# EAGLE design controller (EAGLE 7.4.0)
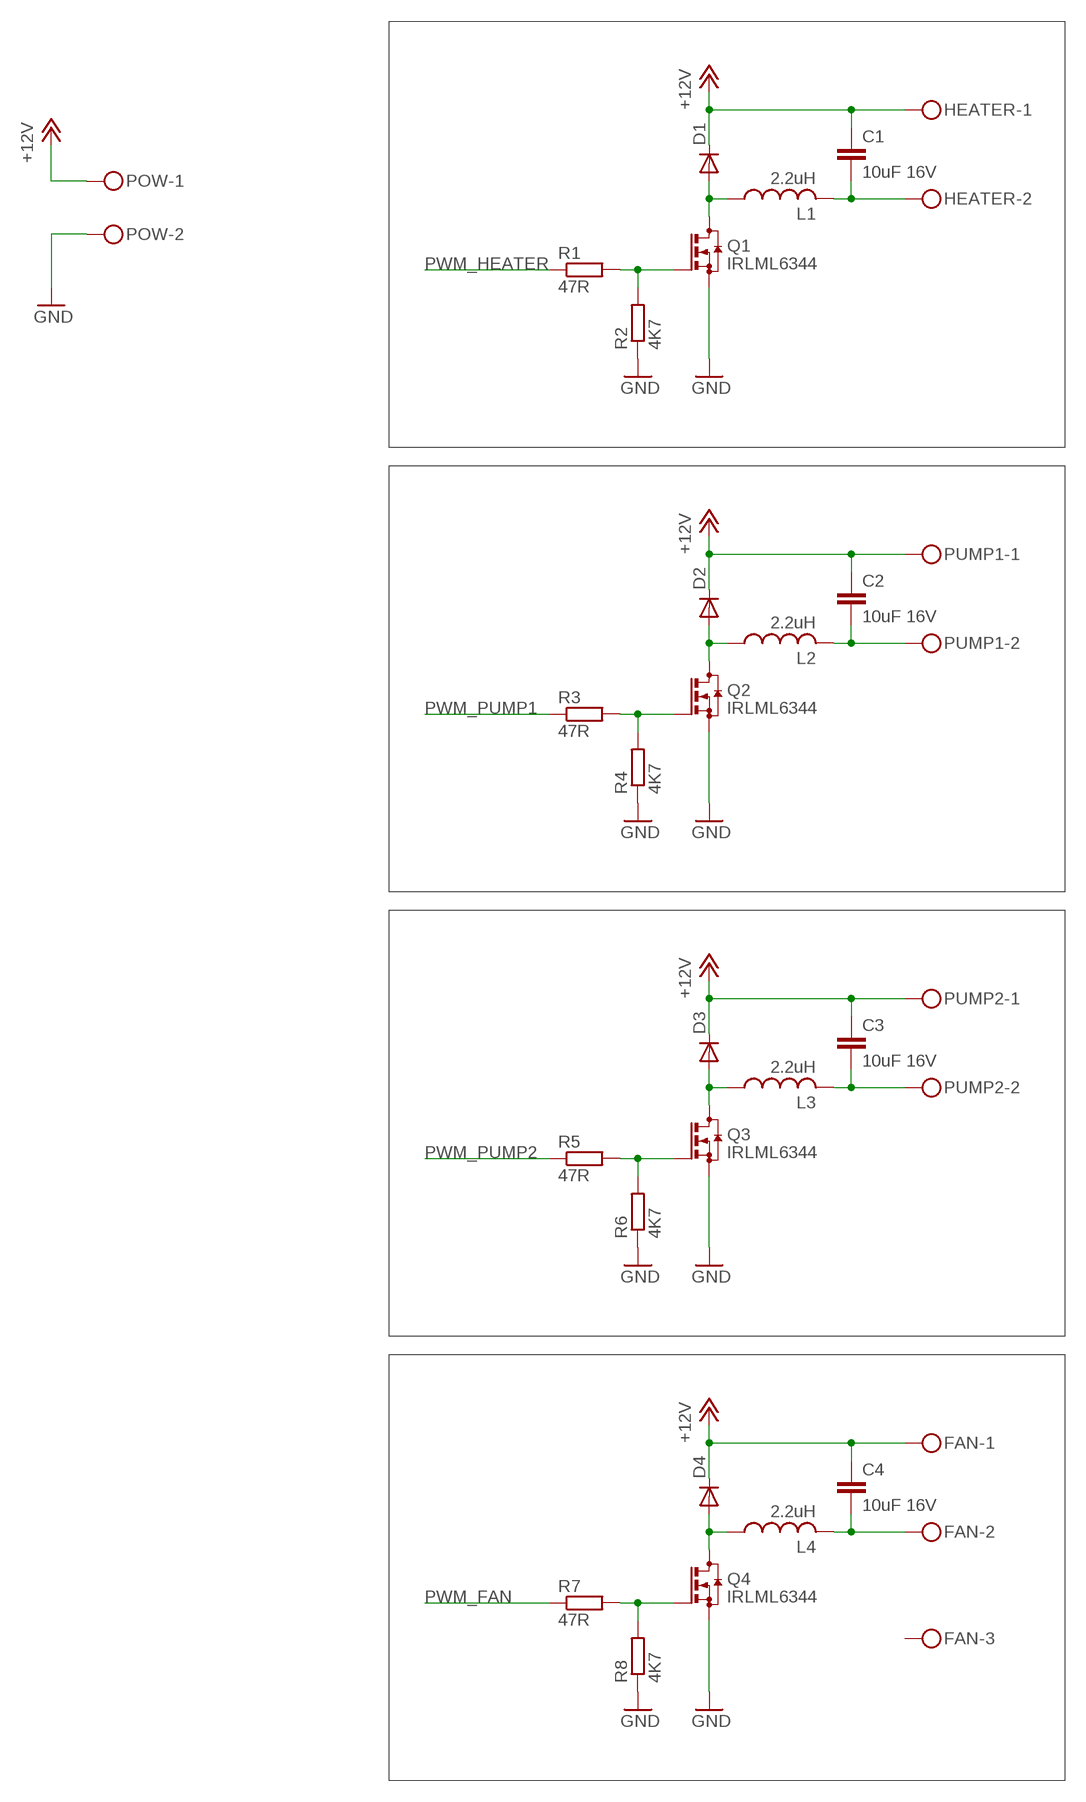
[diagram p0: schematic, sheet 1]

## Parts
C1  10uF 16V  C-EUC1206  [C1206]
C2  10uF 16V  C-EUC1206  [C1206]
C3  10uF 16V  C-EUC1206  [C1206]
C4  10uF 16V  C-EUC1206  [C1206]
D1  DIODE-MINIMELF  [MINIMELF]
D2  DIODE-MINIMELF  [MINIMELF]
D3  DIODE-MINIMELF  [MINIMELF]
D4  DIODE-MINIMELF  [MINIMELF]
FAN  PTSM-0.5/3-2.5-HTHR  [PTSM-0.5/3-2.5-H-THR]
HEATER  PTSM-0.5/2-2.5-HTHR  [PTSM-0.5/2-2.5-H-THR]
L1  2.2uH  L-USL3225M  [L3225M]
L2  2.2uH  L-USL3225M  [L3225M]
L3  2.2uH  L-USL3225M  [L3225M]
L4  2.2uH  L-USL3225M  [L3225M]
POW  PTSM-0.5/2-2.5-HTHR  [PTSM-0.5/2-2.5-H-THR]
PUMP1  PTSM-0.5/2-2.5-HTHR  [PTSM-0.5/2-2.5-H-THR]
PUMP2  PTSM-0.5/2-2.5-HTHR  [PTSM-0.5/2-2.5-H-THR]
Q1  IRLML6344  BSS123  [SOT23]
Q2  IRLML6344  BSS123  [SOT23]
Q3  IRLML6344  BSS123  [SOT23]
Q4  IRLML6344  BSS123  [SOT23]
R1  47R  R-EU_R0603  [R0603]
R2  4K7  R-EU_R0603  [R0603]
R3  47R  R-EU_R0603  [R0603]
R4  4K7  R-EU_R0603  [R0603]
R5  47R  R-EU_R0603  [R0603]
R6  4K7  R-EU_R0603  [R0603]
R7  47R  R-EU_R0603  [R0603]
R8  4K7  R-EU_R0603  [R0603]

## Nets
+12V [hv]: C1.1 C2.1 C3.1 C4.1 D1.C D2.C D3.C D4.C FAN.1A FAN.1B HEATER.1A HEATER.1B POW.1A POW.1B PUMP1.1A PUMP1.1B PUMP2.1A PUMP2.1B
GND: POW.2A POW.2B Q1.2(S) Q2.2(S) Q3.2(S) Q4.2(S) R2.1 R4.1 R6.1 R8.1
N$1: D2.A L2.1 Q2.3(D)
N$2: D1.A L1.1 Q1.3(D)
N$3: C1.2 HEATER.2A HEATER.2B L1.2
N$4: Q1.1(G) R1.2 R2.2
N$5: C2.2 L2.2 PUMP1.2A PUMP1.2B
N$6: Q2.1(G) R3.2 R4.2
N$7: D3.A L3.1 Q3.3(D)
N$8: C3.2 L3.2 PUMP2.2A PUMP2.2B
N$9: Q3.1(G) R5.2 R6.2
N$10: D4.A L4.1 Q4.3(D)
N$11: C4.2 FAN.2A FAN.2B L4.2
N$12: Q4.1(G) R7.2 R8.2
PWM_FAN: R7.1
PWM_HEATER: R1.1
PWM_PUMP1: R3.1
PWM_PUMP2: R5.1
Unconnected: FAN.3A FAN.3B

## Library data of the parts
C1-C4 = rcl:C-EU: CAPACITOR, European symbol
D1-D4 = diode:DIODE-: DIODE
FAN = phoenix-ptsm:PTSM-0.5/3-2.5-H
HEATER POW PUMP1 PUMP2 = phoenix-ptsm:PTSM-0.5/2-2.5-H
L1-L4 = rcl:L-US: INDUCTOR, American symbol
Q1-Q4 = transistor-small-signal:BSS123: N-CHANNEL MOS FET
R1-R8 = rcl:R-EU_: RESISTOR, European symbol

## Net classes
1 hv: clearance 0.4 mm

## Board
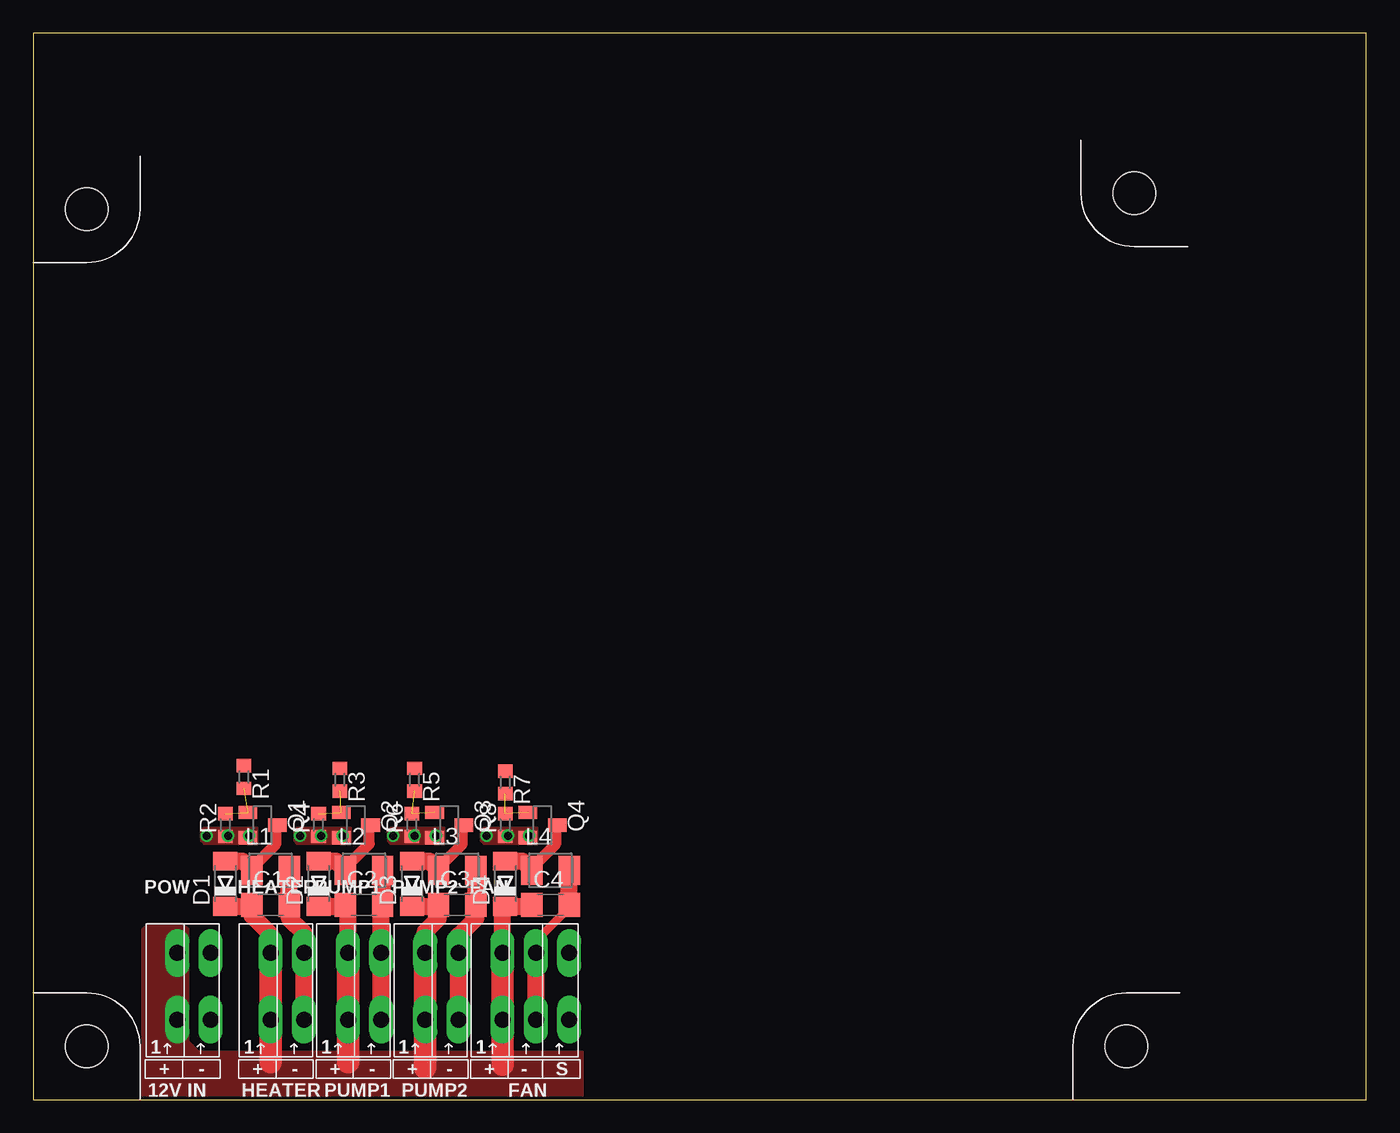
[diagram p1: board, top side]
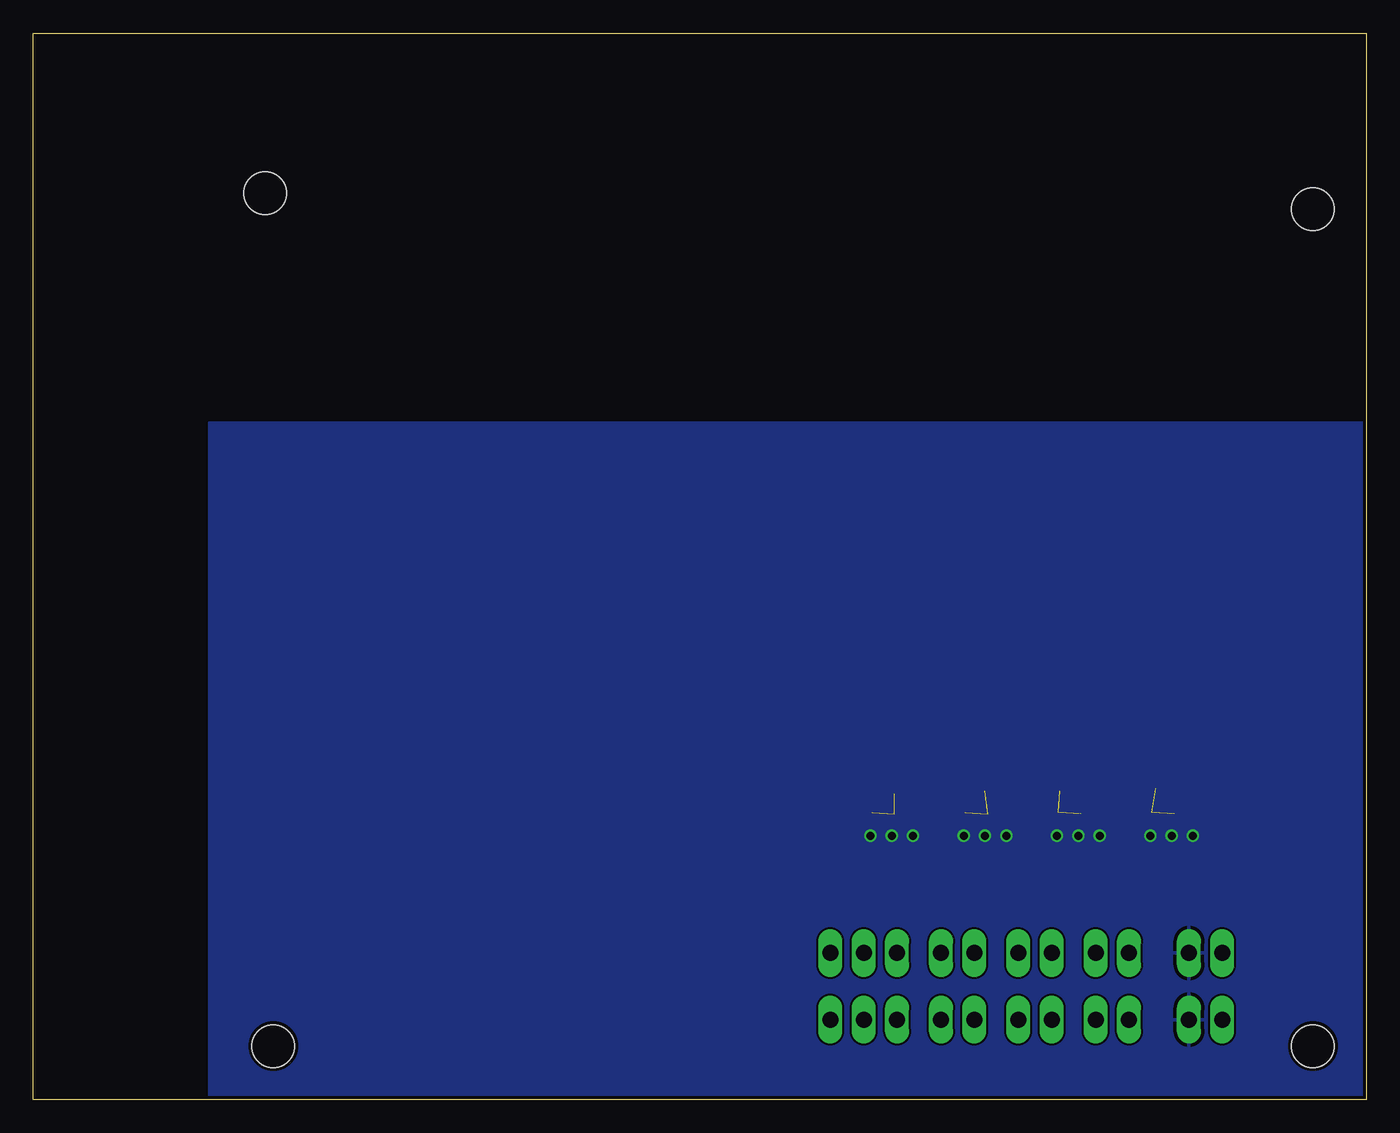
[diagram p2: board, bottom side, seen from below]

Size 100 x 80 mm. Coordinates in mm from the lower left corner, seen from the top.
Outline: 0,0 100,0 100,80 0,80 0,0
Copper layers (1*16): Top 0.035mm / dielectric 1.5mm / Bottom 0.035mm
Design rules "seeed": minimum track width 6mil, minimum drill 0.3mm, track to track 6mil, track to pad 6mil, pad to pad 6mil, via to via 6mil, smd to smd 0mil, copper to edge 10mil, drill to drill 10mil, minimum pad ring 6mil, minimum via ring 6mil, stop-mask expansion 2mil, vias tented up to drill 0.5mm, thermal gap 10mil
Holes 3.2 mm at 4,4 82,4 82.6,68 4,66.8

### Footprints (pad centres in the part's own frame; a part is rotated, then mirrored left to right if it is on the bottom)
C1206 = smd 1.6 x 1.8: 1 -1.4,0; 2 1.4,0
MINIMELF = smd 1.4 x 1.8: A 1.7,0; C -1.7,0
PTSM-0.5/3-2.5-H-THR = drill 1.2 long: 1A 0,-2.2; 1B 0,2.8; 2A 2.5,-2.2; 2B 2.5,2.8; 3A 5,-2.2; 3B 5,2.8
PTSM-0.5/2-2.5-H-THR = drill 1.2 long: 1A 0,-2.2; 1B 0,2.8; 2A 2.5,-2.2; 2B 2.5,2.8
L3225M = smd 1.6 x 2.2: 1 -1.4,0; 2 1.4,0
SOT23 = smd 1 x 1.4: 1 -0.95,-1.1; 2 0.95,-1.1; 3 0,1.1
R0603 = smd 1 x 1.1: 1 -0.85,0; 2 0.85,0

### Placement (x,y rotation side)
C1  17.8,14.6 0 top
C2  24.8,14.6 0 top
C3  31.8,14.6 0 top
C4  38.8,14.6 0 top
D1  14.4,16.2 90 top
D2  21.4,16.2 90 top
D3  28.4,16.2 90 top
D4  35.4,16.2 90 top
FAN  35.2,8.2 0 top
HEATER  17.8,8.2 0 top
L1  17.8,17.2 0 top
L2  24.8,17.2 0 top
L3  31.8,17.2 0 top
L4  38.8,17.2 0 top
POW  10.8,8.2 0 top
PUMP1  23.6,8.2 0 top
PUMP2  29.4,8.2 0 top
Q1  17.2,20.6 270 top
Q2  24.2,20.6 270 top
Q3  31.2,20.6 270 top
Q4  38.2,20.6 270 top
R1  15.8,24.2 270 top
R2  14.4,20.6 90 top
R3  23,24 270 top
R4  21.4,20.6 90 top
R5  28.6,24 270 top
R6  28.4,20.6 90 top
R7  35.4,23.8 270 top
R8  35.4,20.6 90 top

### Tracks (layer width: path | path; a pad name or v marks a point on that pad's centre or on a via)
+12V
  Top 1.27: HEATER.1B 17.8,12.4 16.4,13.8 C1.1 16.3,14.5 D1.C | D2.C 23.3,14.5 C2.1 23.6,14.4 PUMP1.1B | D3.C 30.3,14.5 C3.1 30.4,13.6 29.4,12.6 PUMP2.1B | C4.1 37.3,14.5 D4.C 35.2,14.3 FAN.1B
  Top 1.676: HEATER.1B HEATER.1A 17.8,2.8 | PUMP1.1B PUMP1.1A 23.6,2.8 | PUMP2.1B PUMP2.1A 29.4,2.4 | FAN.1B FAN.1A 35.2,2.6
  pour Top (no thermals): 8.2,0 8.2,12.8 8.6,13.2 11.2,13.2 11.6,12.8 11.6,4.4 12.4,3.6 41.2,3.6 41.2,0
GND  (via drill 0.6)
  other vias: 13,19.8 14.6,19.8 16.2,19.8 20,19.8 23.2,19.8 21.6,19.8 27,19.8 30.2,19.8 28.6,19.8 34,19.8 37.2,19.8 35.6,19.8
  pour Bottom: 0,0 86.8,0 86.8,50.8 0,50.8
  pour Top (no thermals): 12.8,19.2 16.8,19.2 16.8,20.4 12.8,20.4 12.6,20.2 12.6,19.4
  pour Top (no thermals): 19.8,19.2 23.8,19.2 23.8,20.4 19.8,20.4 19.6,20.2 19.6,19.4
  pour Top (no thermals): 26.8,19.2 30.8,19.2 30.8,20.4 26.8,20.4 26.6,20.2 26.6,19.4
  pour Top (no thermals): 33.8,19.2 37.8,19.2 37.8,20.4 33.8,20.4 33.6,20.2 33.6,19.4
N$1
  Top 0.813: L2.1 23.4,17.4 25.2,19.2 25.2,20.5 Q2.3
  Top 1.27: D2.A 22.7,17.9 L2.1
N$2
  Top 0.813: L1.1 16.4,17.4 18.2,19.2 18.2,20.5 Q1.3
  Top 1.27: D1.A 15.7,17.9 L1.1
N$3
  Top 1.27: HEATER.2A HEATER.2B 20.3,12.5 19.2,13.6 C1.2 L1.2
N$4  (2 unrouted)
N$5
  Top 1.27: PUMP1.2A PUMP1.2B 26.1,14.5 C2.2 L2.2
N$6  (2 unrouted)
N$7
  Top 0.813: L3.1 30.4,17.4 32.2,19.2 32.2,20.5 Q3.3
  Top 1.27: D3.A 29.7,17.9 L3.1
N$8
  Top 1.27: PUMP2.2A PUMP2.2B 31.9,12.3 33.2,13.6 C3.2 L3.2
N$9  (2 unrouted)
N$10
  Top 0.813: L4.1 37.4,17.4 39.2,19.2 39.2,20.5 Q4.3
  Top 1.27: D4.A 36.7,17.9 L4.1
N$11
  Top 0.61: FAN.2B 37.7,11.9 39.8,14 39.8,14.2 C4.2
  Top 1.27: FAN.2A FAN.2B | C4.2 L4.2
N$12  (2 unrouted)

### Text on the board
tPlace: + | - | + | - | + | - | + | - | + | - | S | 12V IN | HEATER | PUMP1 | PUMP2 | FAN